# EAGLE design Korg-MS20-VCF (EAGLE 7.2.0)
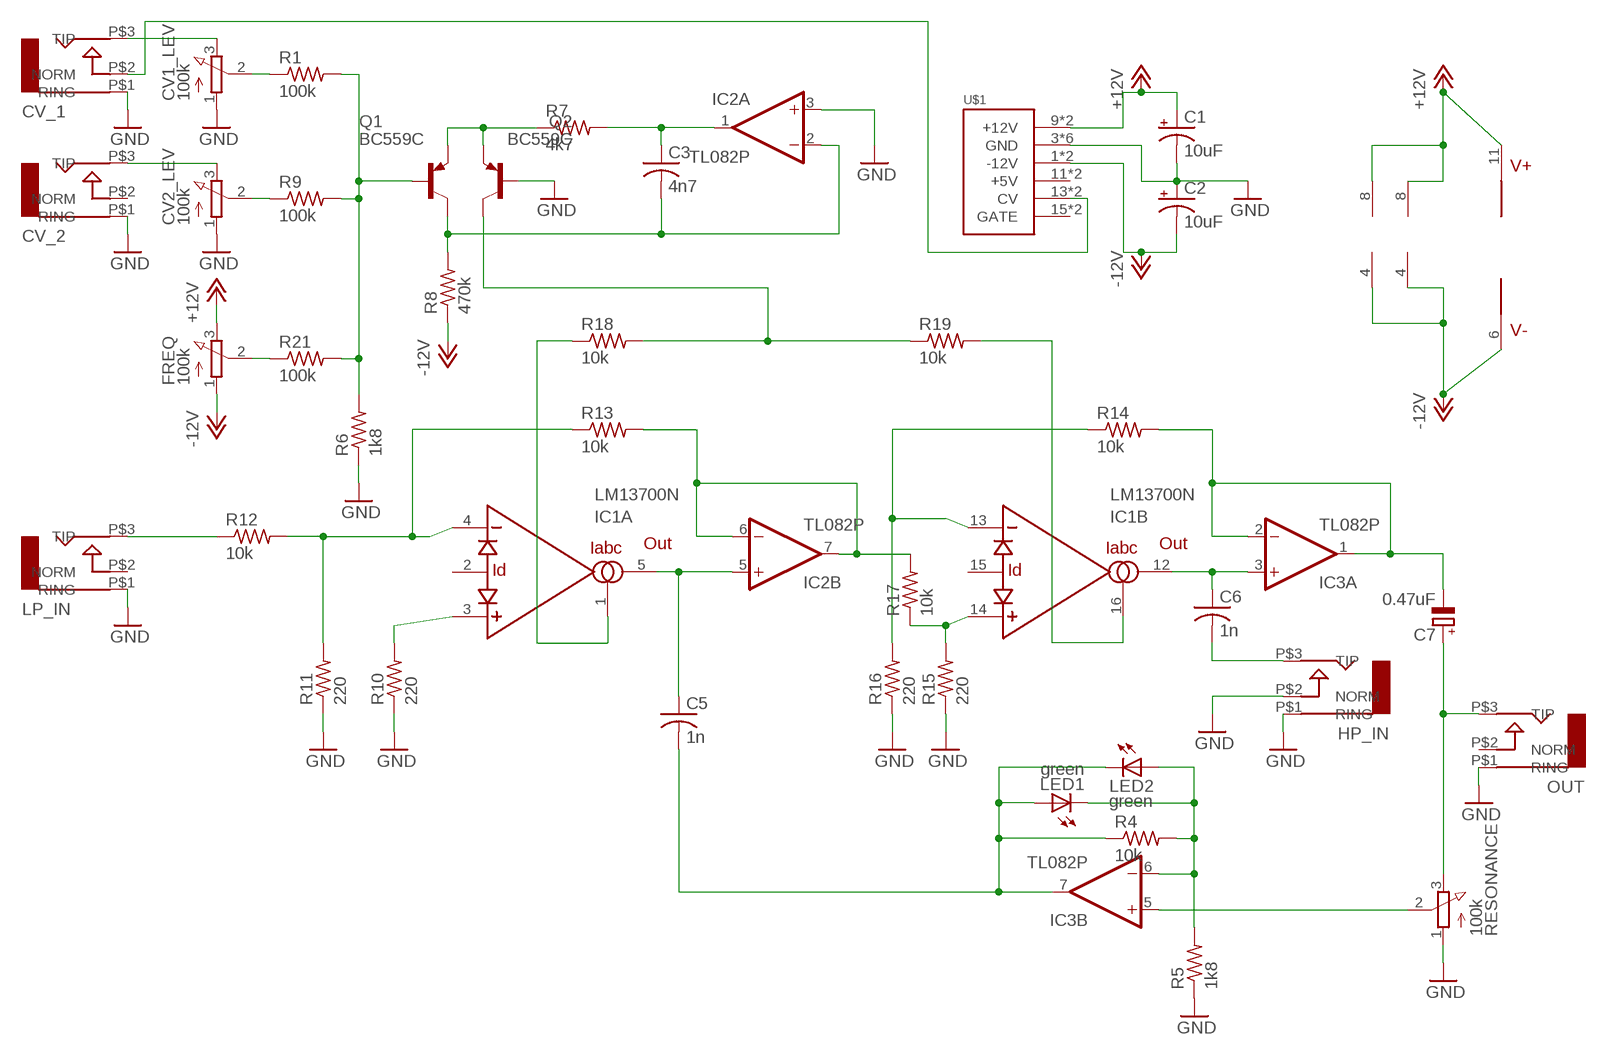
[diagram p0: schematic, sheet 1]

## Parts
C1  10uF  CPOL-USB45181A  [B45181A]
C2  10uF  CPOL-USB45181A  [B45181A]
C3  4n7  C-US050-024X044  [C050-024X044]
C5  1n  C-US050-024X044  [C050-024X044]
C6  1n  C-US050-024X044  [C050-024X044]
C7  0.47uF  CPOL-EUB45181B  [B45181B]
CV1_LEV  100k  3RP/1610N  [3RP/1610N]
CV2_LEV  100k  3RP/1610N  [3RP/1610N]
CV_1  AUDIO-JACK  [ERTHENVAR-JACK-90DEG]
CV_2  AUDIO-JACK  [ERTHENVAR-JACK-90DEG]
FREQ  100k  3RP/1610N  [3RP/1610N]
HP_IN  AUDIO-JACK  [ERTHENVAR-JACK-90DEG]
IC1  LM13700N  [DIL16]
IC2  TL082P  [DIL08]
IC3  TL082P  [DIL08]
LED1  green  LED5MM  [LED5MM]
LED2  green  LED5MM  [LED5MM]
LP_IN  AUDIO-JACK  [ERTHENVAR-JACK-90DEG]
OUT  AUDIO-JACK  [ERTHENVAR-JACK-90DEG]
Q1  BC559C  [TO92-EBC]
Q2  BC559C  [TO92-EBC]
R1  100k  R-US_0207/10  [0207/10]
R4  10k  R-US_0207/10  [0207/10]
R5  1k8  R-US_0207/10  [0207/10]
R6  1k8  R-US_0207/10  [0207/10]
R7  4k7  R-US_0207/10  [0207/10]
R8  470k  R-US_0207/10  [0207/10]
R9  100k  R-US_0207/10  [0207/10]
R10  220  R-US_0207/10  [0207/10]
R11  220  R-US_0207/10  [0207/10]
R12  10k  R-US_0207/10  [0207/10]
R13  10k  R-US_0207/10  [0207/10]
R14  10k  R-US_0207/10  [0207/10]
R15  220  R-US_0207/10  [0207/10]
R16  220  R-US_0207/10  [0207/10]
R17  10k  R-US_0207/10  [0207/10]
R18  10k  R-US_0207/10  [0207/10]
R19  10k  R-US_0207/10  [0207/10]
R21  100k  R-US_0207/10  [0207/10]
RESONANCE  100k  3RP/1610N  [3RP/1610N]
U$1  POWER  [POWER_16]

## Nets
+12V: C1.+ FREQ.3(E) IC1.11(5:V+) IC2.8(P:V+) IC3.8(P:V+) U$1.9(+12V) U$1.10(+12V)
-12V: C2.- FREQ.1(A) IC1.6(5:V-) IC2.4(P:V-) IC3.4(P:V-) R8.1 U$1.1(-12V) U$1.2(-12V)
GND: C1.- C2.+ CV1_LEV.1(A) CV2_LEV.1(A) CV_1.P$1(RING) CV_2.P$1(RING) HP_IN.P$1(RING) HP_IN.P$2(NORM) IC2.3(A:+IN) LP_IN.P$1(RING) OUT.P$1(RING) Q2.B R5.1 R6.1 R10.1 R11.1 R15.1 R16.1 RESONANCE.1(A) U$1.3(GND) U$1.4(GND) U$1.5(GND) U$1.6(GND) U$1.7(GND) U$1.8(GND)
N$1: IC3.6(B:-IN) LED1.K(C) LED2.A R4.2 R5.2
N$2: C5.2 IC3.7(B:OUT) LED1.A LED2.K(C) R4.1
N$3: C3.2 IC2.2(A:-IN) Q1.C R8.2
N$4: C3.1 IC2.1(A:OUT) R7.2
N$5: Q1.E Q2.E R7.1
N$6: IC3.5(B:+IN) RESONANCE.2(S)
N$7: CV1_LEV.2(S) R1.1
N$8: CV2_LEV.2(S) R9.1
N$9: C5.1 IC1.5(A:OUT) IC2.5(B:+IN)
N$10: C6.1 IC1.12(B:OUT) IC3.3(A:+IN)
N$11: C7.- IC3.1(A:OUT) IC3.2(A:-IN) R14.2
N$12: C7.+ OUT.P$3(TIP) RESONANCE.3(E)
N$13: IC1.1(A:IABC) R18.1
N$14: IC1.4(A:-IN) R11.2 R12.2 R13.1
N$15: IC1.3(A:+IN) R10.2
N$16: Q2.C R18.2 R19.1
N$17: IC1.16(B:IABC) R19.2
N$18: IC1.13(B:-IN) R14.1 R16.2
N$19: IC2.6(B:-IN) IC2.7(B:OUT) R13.2 R17.2
N$20: IC1.14(B:+IN) R15.2 R17.1
N$21: Q1.B R1.2 R6.2 R9.2 R21.2
N$22: FREQ.2(S) R21.1
N$23: CV2_LEV.3(E) CV_2.P$3(TIP)
N$24: CV1_LEV.3(E) CV_1.P$3(TIP)
N$25: LP_IN.P$3(TIP) R12.1
N$26: C6.2 HP_IN.P$3(TIP)
N$27: CV_1.P$2(NORM) U$1.13(CV) U$1.14(CV)
Unconnected: CV_2.P$2(NORM) IC1.2(A:ID) IC1.7(3:IN) IC1.8(3:OUT) IC1.9(4:OUT) IC1.10(4:IN) IC1.15(B:ID) LP_IN.P$2(NORM) OUT.P$2(NORM) U$1.11(+5V) U$1.12(+5V) U$1.15(GATE) U$1.16(GATE)

## Library data of the parts
C1 C2 = rcl:CPOL-US: POLARIZED CAPACITOR, American symbol
C3 C5 C6 = rcl:C-US: CAPACITOR, American symbol
C7 = rcl:CPOL-EU: POLARIZED CAPACITOR, European symbol
CV1_LEV CV2_LEV FREQ RESONANCE = pot:3RP/1610N: 16mm Potentiometer one level Source: http://www.alphapotentiometers.net/html/16mm_pot_2.html
CV_1 CV_2 HP_IN LP_IN OUT = erthenvar:AUDIO-JACK: Switching Mono 3.5mm Audio Jack from Erthenvar.
IC1 = synthdiy:LM13700: National Dual OTA with buffers.
IC2 IC3 = linear:TL082: OP AMP Data sheet <http://www.ti.com/lit/ds/symlink/tl084a . pdf>; DATA_SHEET: <a href="http://www.ti.com/lit/ds/symlink/tl084a.pdf"> Data sheet </a>
LED1 LED2 = led:LED: LED OSRAM: - CHIPLED LG R971, LG N971, LY N971, LG Q971, LY Q971, LO R971, LY R971 LH N974, LH R974 LS Q976, LO Q976, LY Q976 LO Q996 - Hyper CHIPLED LW Q18S LB Q993, LB Q99A, LB R99A - SideLED LS A670, LO A670, LY A670, LG A670, LP A670 LB A673, LV A673, LT A673, LW A673 LH A674 LY A675 LS A676, LA A676, LO A676, LY A676, LW A676 LS A679, LY A679, LG A679 - Hyper Micro SIDELED® LS Y876, LA Y876, LO Y876, LY Y876 LT Y87S - SmartLED LW L88C, LW L88S LB L89C, LB L89S, LG L890 LS L89K, LO L89K, LY L89K LS L896, LA L896, LO L896, LY L896 - TOPLED LS T670, LO T670, LY T670, LG T670, LP T670 LSG T670, LSP T670, LSY T670, LOP T670, LYG T670 LG T671, LOG T671, LSG T671 LB T673, LV T673, LT T673, LW T673 LH T674 LS T676, LA T676, LO T676, LY T676, LB T676, LH T676, LSB T676, LW T676 LB T67C, LV T67C, LT T67C, LS T67K, LO T67K, LY T67K, LW E67C LS E67B, LA E67B, LO E67B, LY E67B, LB E67C, LV E67C, LT E67C LW T67C LS T679, LY T679, LG T679 LS T770, LO T770, LY T770, LG T770, LP T770 LB T773, LV T773, LT T773, LW T773 LH T774 LS E675, LA E675, LY E675, LS T675 LS T776, LA T776, LO T776, LY T776, LB T776 LHGB T686 LT T68C, LB T68C - Hyper Mini TOPLED® LB M676 - Mini TOPLED Santana® LG M470 LS M47K, LO M47K, LY M47K Source: http://www.osram.convergy.de LUXEON: - LUMILED® LXK2-PW12-R00, LXK2-PW12-S00, LXK2-PW14-U00, LXK2-PW14-V00 LXK2-PM12-R00, LXK2-PM12-S00, LXK2-PM14-U00 LXK2-PE12-Q00, LXK2-PE12-R00, LXK2-PE12-S00, LXK2-PE14-T00, LXK2-PE14-U00 LXK2-PB12-K00, LXK2-PB12-L00, LXK2-PB12-M00, LXK2-PB14-N00, LXK2-PB14-P00, LXK2-PB14-Q00 LXK2-PR12-L00, LXK2-PR12-M00, LXK2-PR14-Q00, LXK2-PR14-R00 LXK2-PD12-Q00, LXK2-PD12-R00, LXK2-PD12-S00 LXK2-PH12-R00, LXK2-PH12-S00 LXK2-PL12-P00, LXK2-PL12-Q00, LXK2-PL12-R00 Source: www.luxeon.com KINGBRIGHT: KA-3528ASYC Source: www.kingbright.com
Q1 Q2 = transistor-pnp:BC559*: PNP Transistror
R1 R4-R19 R21 = rcl:R-US_: RESISTOR, American symbol
U$1 = eurorack:POWER

## Board
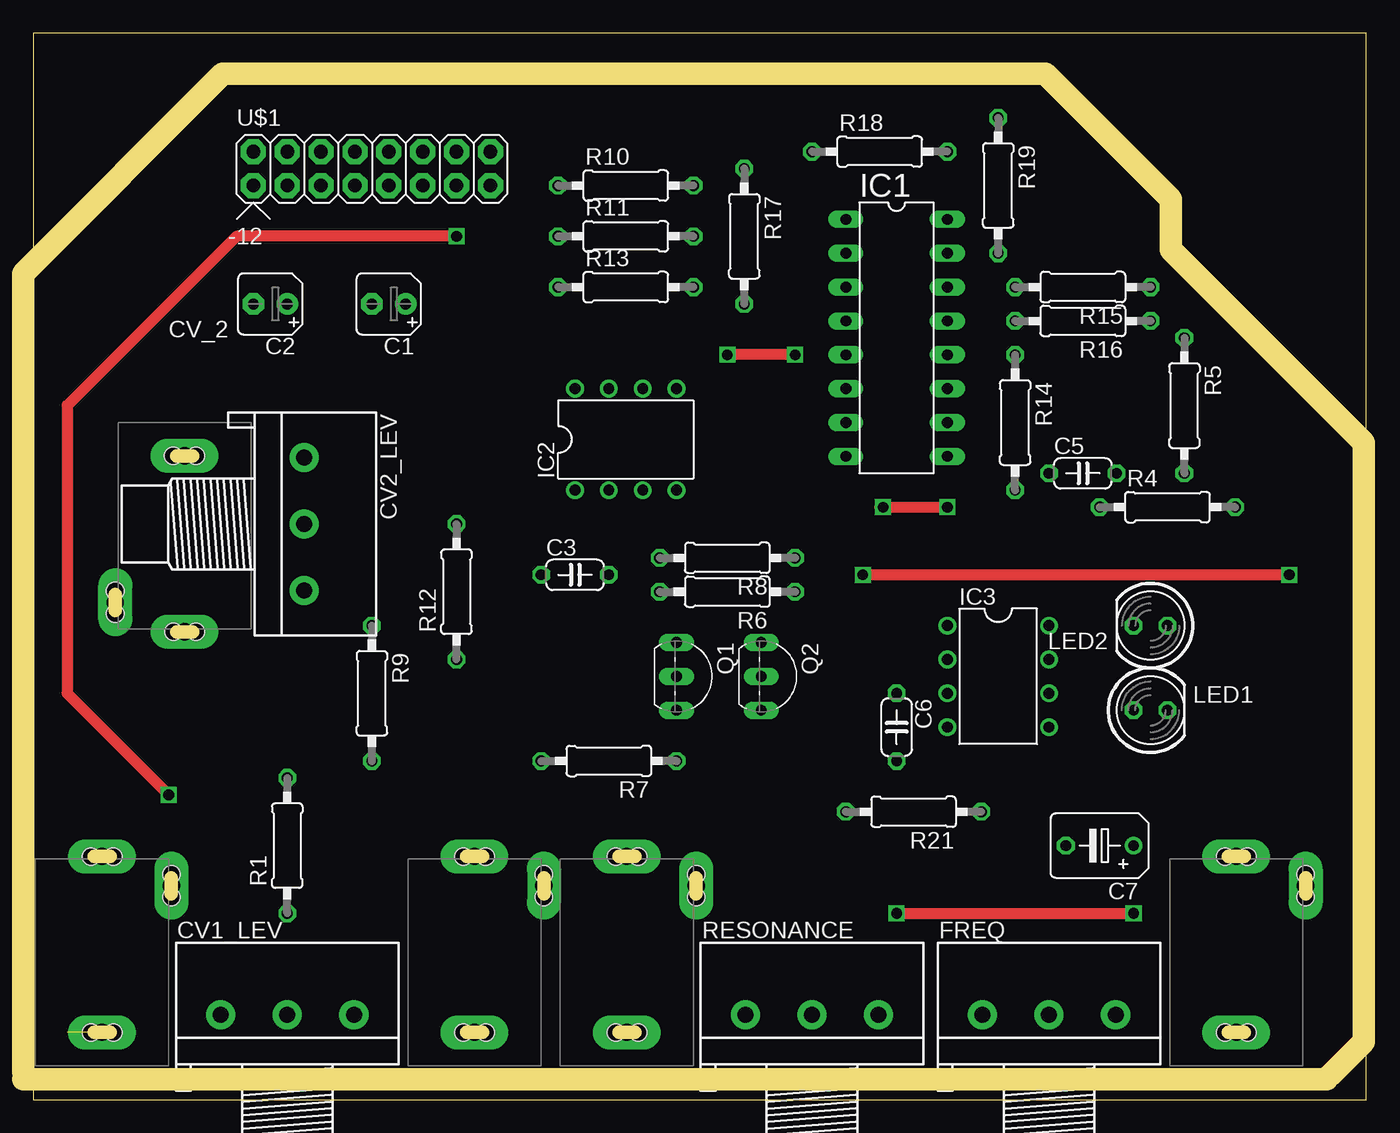
[diagram p1: board, top side]
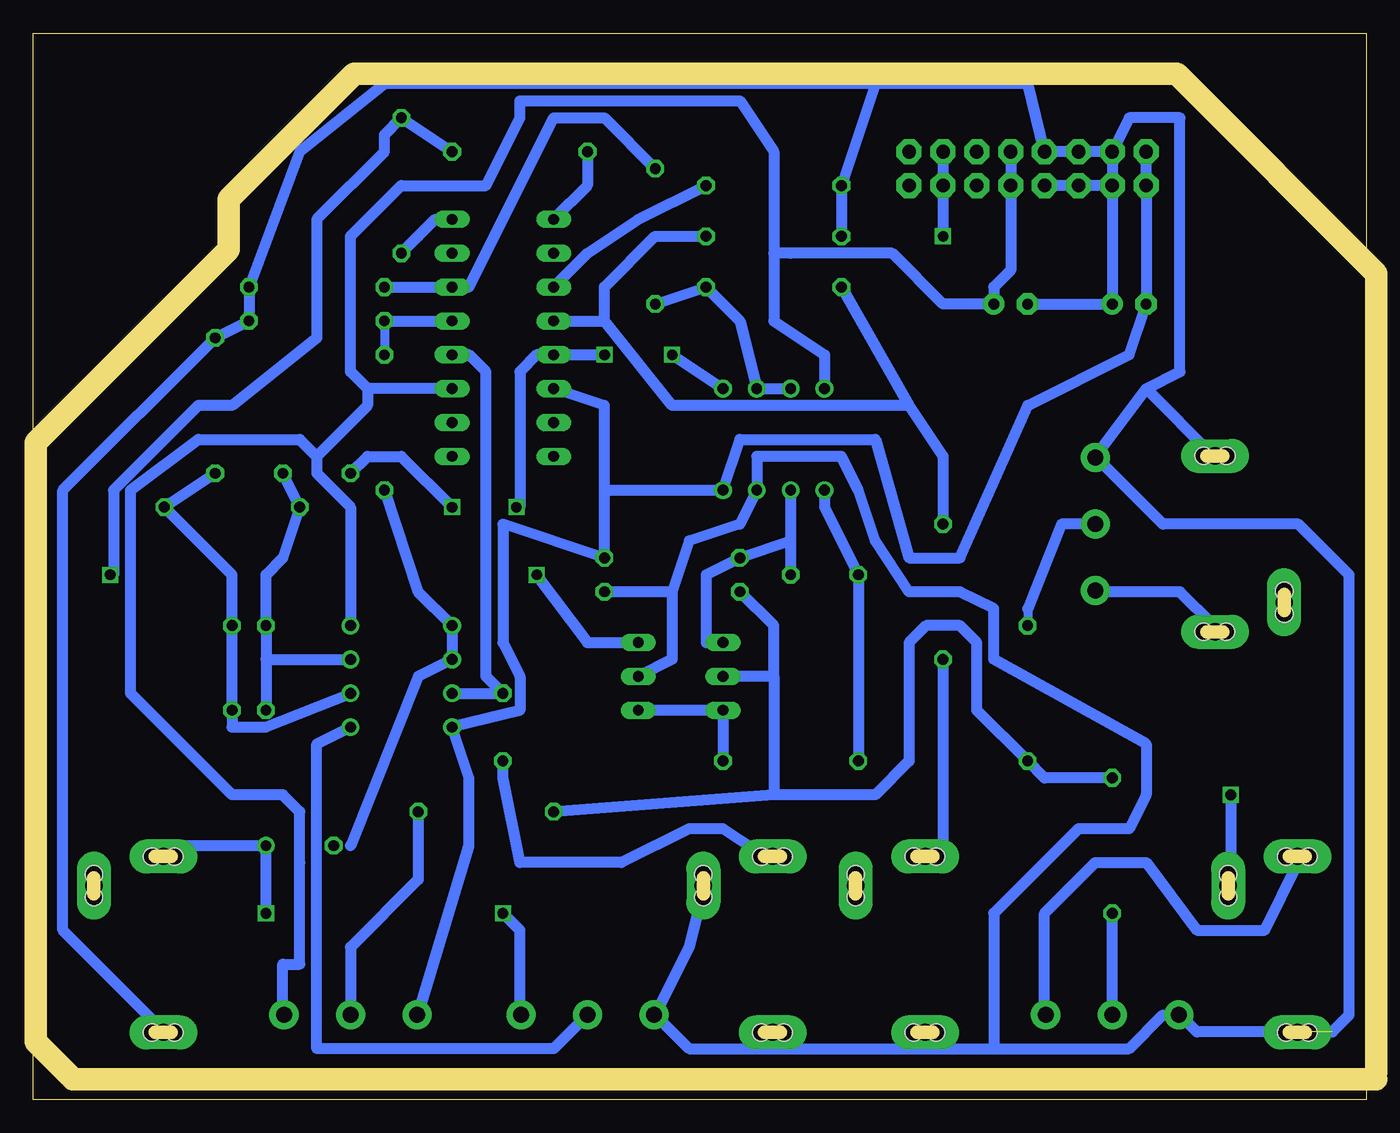
[diagram p2: board, bottom side, seen from below]

Size 100 x 80 mm. Coordinates in mm from the lower left corner, seen from the top.
Outline: 0,0 100,0 100,80 0,80 0,0
Copper layers (1*16): Top 0.035mm / dielectric 1.5mm / Bottom 0.035mm
Design rules "default *": minimum track width 26mil, minimum drill 31mil, track to track 16mil, track to pad 16mil, pad to pad 16mil, via to via 16mil, smd to smd 8mil, copper to edge 0mil, drill to drill 16mil, minimum pad ring 10mil, minimum via ring 8mil, stop-mask expansion 4mil, vias tented up to drill 0mil, thermal gap 10mil
Milling: 9 lines

### Footprints (pad centres in the part's own frame; a part is rotated, then mirrored left to right if it is on the bottom)
B45181A = drill 0.813 pad 1.6: + -1.27,0 | drill 0.813 pad 1.6 octagon: - 1.27,0
C050-024X044 = drill 0.813 octagon: 1 -2.54,0; 2 2.54,0
B45181B = drill 0.813: + -2.54,0 | drill 0.813 octagon: - 2.54,0
3RP/1610N = drill 1.2 pad 2.184: 1 -5,0; 2 0,0; 3 5,0
ERTHENVAR-JACK-90DEG = drill 1.3 pad 2.54 long: P$1 5,-2.5; P$2 -0.2,-13.5; P$3 5,-15.7 | hole 1.3: 5.842,-2.489; 4.14,-2.489; -0.203,-12.649; -0.203,-14.351; 5.842,-15.697; 4.166,-15.697
DIL16 = drill 0.813 long: 1 -8.89,-3.81; 2 -6.35,-3.81; 3 -3.81,-3.81; 4 -1.27,-3.81; 5 1.27,-3.81; 6 3.81,-3.81; 7 6.35,-3.81; 8 8.89,-3.81; 9 8.89,3.81; 10 6.35,3.81; 11 3.81,3.81; 12 1.27,3.81; 13 -1.27,3.81; 14 -3.81,3.81; 15 -6.35,3.81; 16 -8.89,3.81
DIL08 = drill 0.813 pad 1.27: 1 -3.81,-3.81; 2 -1.27,-3.81; 3 1.27,-3.81; 4 3.81,-3.81; 5 3.81,3.81; 6 1.27,3.81; 7 -1.27,3.81; 8 -3.81,3.81
LED5MM = drill 0.813 octagon: A -1.27,0; K 1.27,0
TO92-EBC = drill 0.813 long: B 0,-1.27; C -2.54,-1.27; E 2.54,-1.27
0207/10 = drill 0.813 octagon: 1 -5.08,0; 2 5.08,0
POWER_16 = drill 1.016 pad 1.88 octagon: 1 -6.35,-1.27; 2 -6.35,1.27; 3 -3.81,-1.27; 4 -3.81,1.27; 5 -1.27,-1.27; 6 -1.27,1.27; 7 1.27,-1.27; 8 1.27,1.27; 9 3.81,-1.27; 10 3.81,1.27; 11 6.35,-1.27; 12 6.35,1.27; 13 8.89,-1.27; 14 8.89,1.27; 15 11.43,-1.27; 16 11.43,1.27

### Placement (x,y rotation side)
C1  26.67,59.69 180 top
C2  17.78,59.69 180 top
C3  40.64,39.37 0 top
C5  78.74,46.99 0 top
C6  64.77,27.94 270 top
C7  80.01,19.05 180 top
CV1_LEV  19.05,6.35 0 top
CV2_LEV  20.32,43.18 270 top
CV_1  10.16,2.54 180 top
CV_2  6.35,50.8 0 top
FREQ  76.2,6.35 0 top
HP_IN  49.53,2.54 180 top
IC1  64.77,57.15 270 top
IC2  44.45,49.53 0 top
IC3  72.39,31.75 270 top
LED1  83.82,29.21 0 top
LED2  83.82,35.56 180 top
LP_IN  38.1,2.54 180 top
OUT  95.25,2.54 180 top
Q1  49.53,31.75 270 top
Q2  55.88,31.75 270 top
R1  19.05,19.05 90 top
R4  85.09,44.45 0 top
R5  86.36,52.07 270 top
R6  52.07,38.1 180 top
R7  43.18,25.4 180 top
R8  52.07,40.64 180 top
R9  25.4,30.48 270 top
R10  44.45,68.58 0 top
R11  44.45,64.77 0 top
R12  31.75,38.1 90 top
R13  44.45,60.96 0 top
R14  73.66,50.8 270 top
R15  78.74,60.96 180 top
R16  78.74,58.42 180 top
R17  53.34,64.77 270 top
R18  63.5,71.12 0 top
R19  72.39,68.58 270 top
R21  66.04,21.59 180 top
RESONANCE  58.42,6.35 0 top
U$1  22.86,69.85 0 top

### Tracks (layer width: path | path; a pad name or v marks a point on that pad's centre or on a via)
+12V
  Bottom 0.813: U$1.10 U$1.9 26.67,62.23 27.94,60.96 C1.+ 31.75,59.69 35.56,63.5 43.18,63.5 44.45,63.5 | IC1.11 74.93,53.34 | 74.93,53.34 76.2,54.61 76.2,64.77 72.39,68.58 66.04,68.58 63.5,73.66 | 63.5,73.66 | 63.5,73.66 63.5,74.93 46.99,74.93 44.45,71.12 44.45,63.5 | 44.45,63.5 44.45,58.42 40.64,55.88 IC2.8 | 74.93,53.34 74.93,52.07 78.74,48.26 | 78.74,48.26 | 78.74,48.26 78.74,46.99 76.2,44.45 IC3.8 | 81.28,6.35 81.28,10.16 80.01,10.16 80.01,17.78 | 80.01,17.78 | 80.01,17.78 80.01,21.59 81.28,22.86 85.09,22.86 92.71,30.48 92.71,45.72 87.63,49.53 80.01,49.53 78.74,48.26
-12V
  Bottom 0.66: 71.12,6.35
  Bottom 0.813: 71.12,6.35 67.31,19.05 67.31,24.13 IC3.4 63.5,29.21 63.5,31.75 64.77,34.29 64.77,43.18 R8.1 57.15,45.72 | U$1.2 U$1.1 C2.- 17.78,55.88 25.4,52.07 30.48,40.64 34.29,40.64 36.83,49.53 46.99,49.53 IC2.4 57.15,45.72 | IC1.6 57.15,52.07 57.15,45.72
GND  (1 unrouted)
  Bottom 0.61: 11.43,48.26 | 44.45,3.81 | 49.53,16.51 | 53.34,6.35 | 33.02,5.08 | 90.17,5.08
  Bottom 0.66: 15.24,6.35 13.97,6.35 | 20.32,48.26 | 20.32,48.26 | 53.34,6.35
  Bottom 0.813: C1.- C2.+ U$1.3 | R11.1 R10.1 36.83,76.2 | U$1.4 U$1.3 | U$1.3 U$1.5 U$1.7 | U$1.4 U$1.6 U$1.8 25.4,76.2 36.83,76.2 | 36.83,76.2 73.66,76.2 80.01,71.12 R15.1 R16.1 R5.1 97.79,45.72 97.79,12.7 90.17,5.08 | Q2.B 52.07,33.02 52.07,38.1 | 52.07,38.1 50.8,41.91 46.99,43.18 | 46.99,43.18 IC2.3 45.72,48.26 39.37,48.26 38.1,45.72 36.83,41.91 34.29,38.1 30.48,38.1 27.94,36.83 27.94,33.02 16.51,26.67 16.51,22.86 17.78,20.32 21.59,20.32 27.94,13.97 27.94,3.81 | 46.99,43.18 | 52.07,38.1 R6.1 | 15.24,6.35 17.78,3.81 27.94,3.81 | 44.45,3.81 50.8,3.81 53.34,6.35 50.8,11.43 49.53,16.51 | 44.45,3.81 33.02,3.81 | 33.02,3.81 27.94,3.81 | 2.54,5.08 1.27,6.35 1.27,39.37 5.08,43.18 15.24,43.18 20.32,48.26 16.51,53.34 | U$1.4 17.78,73.66 13.97,73.66 13.97,54.61 16.51,53.34 | 5.08,5.08 12.7,5.08 13.97,6.35 | 11.43,48.26 16.51,53.34 | 44.45,5.08 44.45,3.81 | 33.02,3.81 33.02,5.08
N$1
  Bottom 0.66: IC3.6
  Bottom 0.813: R5.2 R4.2 85.09,39.37 LED2.A LED1.K 85.09,27.94 82.55,27.94 IC3.6
N$2
  Bottom 0.813: C5.2 R4.1 81.28,40.64 82.55,39.37 LED2.K 82.55,33.02 | 82.55,33.02 LED1.A | 82.55,33.02 IC3.7
N$3
  Bottom 0.66: 49.53,34.29 Q1.C
  Bottom 0.813: 43.18,41.91 C3.2 | IC2.2 43.18,41.91 | 43.18,41.91 R8.2 49.53,39.37 49.53,34.29
N$4
  Bottom 0.813: IC2.1 40.64,44.45 C3.1 R7.2
N$5
  Bottom 0.813: R7.1 Q1.E Q2.E
N$6
  Bottom 0.813: IC3.5 78.74,26.67 78.74,3.81 60.96,3.81 RESONANCE.2
N$7
  Bottom 0.813: CV1_LEV.2 R1.1
N$8
  Bottom 0.66: 25.4,36.83 R9.1
  Bottom 0.813: 25.4,36.83 22.86,43.18 CV2_LEV.2
N$9  (via drill 0.8 pad 0.81)
  Top 0.813: 63.5,44.45 v68.58,44.45 | v57.15,55.88 v52.07,55.88
  Bottom 0.813: 63.5,44.45 63.5,54.61 62.23,55.88 IC1.5 v57.15,55.88 | v52.07,55.88 IC2.5 | C5.1 74.93,48.26 72.39,48.26 v68.58,44.45
  other vias: 63.75,44.45
N$10
  Bottom 0.813: IC1.12 67.31,55.88 66.04,54.61 66.04,31.75 C6.1 IC3.3
N$11
  Bottom 0.813: 76.2,19.05 71.12,31.75 IC3.2 IC3.1 71.12,38.1 R14.2
N$12  (via drill 0.8 pad 0.81)
  Top 0.813: v64.77,13.97 v82.55,13.97
  Bottom 0.61: 88.9,19.05 90.17,17.78
  Bottom 0.813: C7.+ 88.9,19.05 | 63.5,6.35 63.5,12.7 v64.77,13.97 | v82.55,13.97 C7.+ | C7.+
N$13
  Bottom 0.813: IC1.1 58.42,68.58 R18.1
N$14
  Bottom 0.813: R12.2 31.75,48.26 34.29,52.07 | R13.1 34.29,52.07 | R11.2 53.34,64.77 57.15,60.96 57.15,58.42 | 57.15,58.42 | 57.15,58.42 52.07,52.07 34.29,52.07 | IC1.4 57.15,58.42
N$15
  Bottom 0.66: IC1.3
  Bottom 0.813: R10.2 54.61,66.04 58.42,63.5 IC1.3
N$16  (via drill 0.8 pad 0.81)
  Top 0.813: 93.98,39.37 v62.23,39.37
  Bottom 0.813: R18.2 R19.1 73.66,72.39 73.66,71.12 78.74,66.04 78.74,57.15 85.09,52.07 87.63,52.07 93.98,45.72 93.98,39.37 | v62.23,39.37 58.42,34.29 Q2.C
  other vias: 94.23,39.37
N$17
  Bottom 0.66: IC1.16 69.85,66.04
  Bottom 0.813: R19.2 71.12,64.77 69.85,66.04
N$18
  Bottom 0.66: R16.2 R14.1
  Bottom 0.813: R16.2 IC1.13
N$19
  Bottom 0.66: IC2.6
  Bottom 0.813: IC2.7 IC2.6 46.99,58.42 R13.2 R17.2
N$20
  Bottom 0.813: R15.2 IC1.14 67.31,60.96 60.96,73.66 57.15,73.66 R17.1
N$21
  Bottom 0.813: R6.2 44.45,35.56 44.45,31.75 | 44.45,31.75 Q1.B | R1.2 24.13,24.13 R9.2 29.21,29.21 29.21,34.29 30.48,35.56 33.02,35.56 34.29,34.29 34.29,25.4 36.83,22.86 44.45,22.86 | 44.45,22.86 R21.2 | 44.45,31.75 44.45,22.86
N$22
  Bottom 0.813: R21.1 71.12,16.51 76.2,11.43 FREQ.2
N$23
  Bottom 0.61: 11.43,35.56 | 20.32,38.1
  Bottom 0.813: 11.43,35.56 13.97,38.1 20.32,38.1
N$24
  Bottom 0.813: 24.13,6.35 24.13,13.97 20.32,17.78 16.51,17.78 12.7,12.7 7.62,12.7 5.08,17.78
N$25
  Bottom 0.813: R12.1 31.75,19.05 33.02,17.78
N$26
  Bottom 0.813: 44.45,17.78 48.26,20.32 50.8,20.32 55.88,17.78 63.5,17.78 64.77,24.13 C6.2
N$27  (via drill 0.8 pad 0.81)
  Top 0.813: v31.75,64.77 15.24,64.77 2.54,52.07 2.54,30.48 v10.16,22.86
  Bottom 0.813: U$1.14 U$1.13 v31.75,64.77 | v10.16,22.86 10.16,16.51 | 10.16,16.51